# EAGLE design TeslaBMS_Shield_4 (EAGLE 6.6.0)
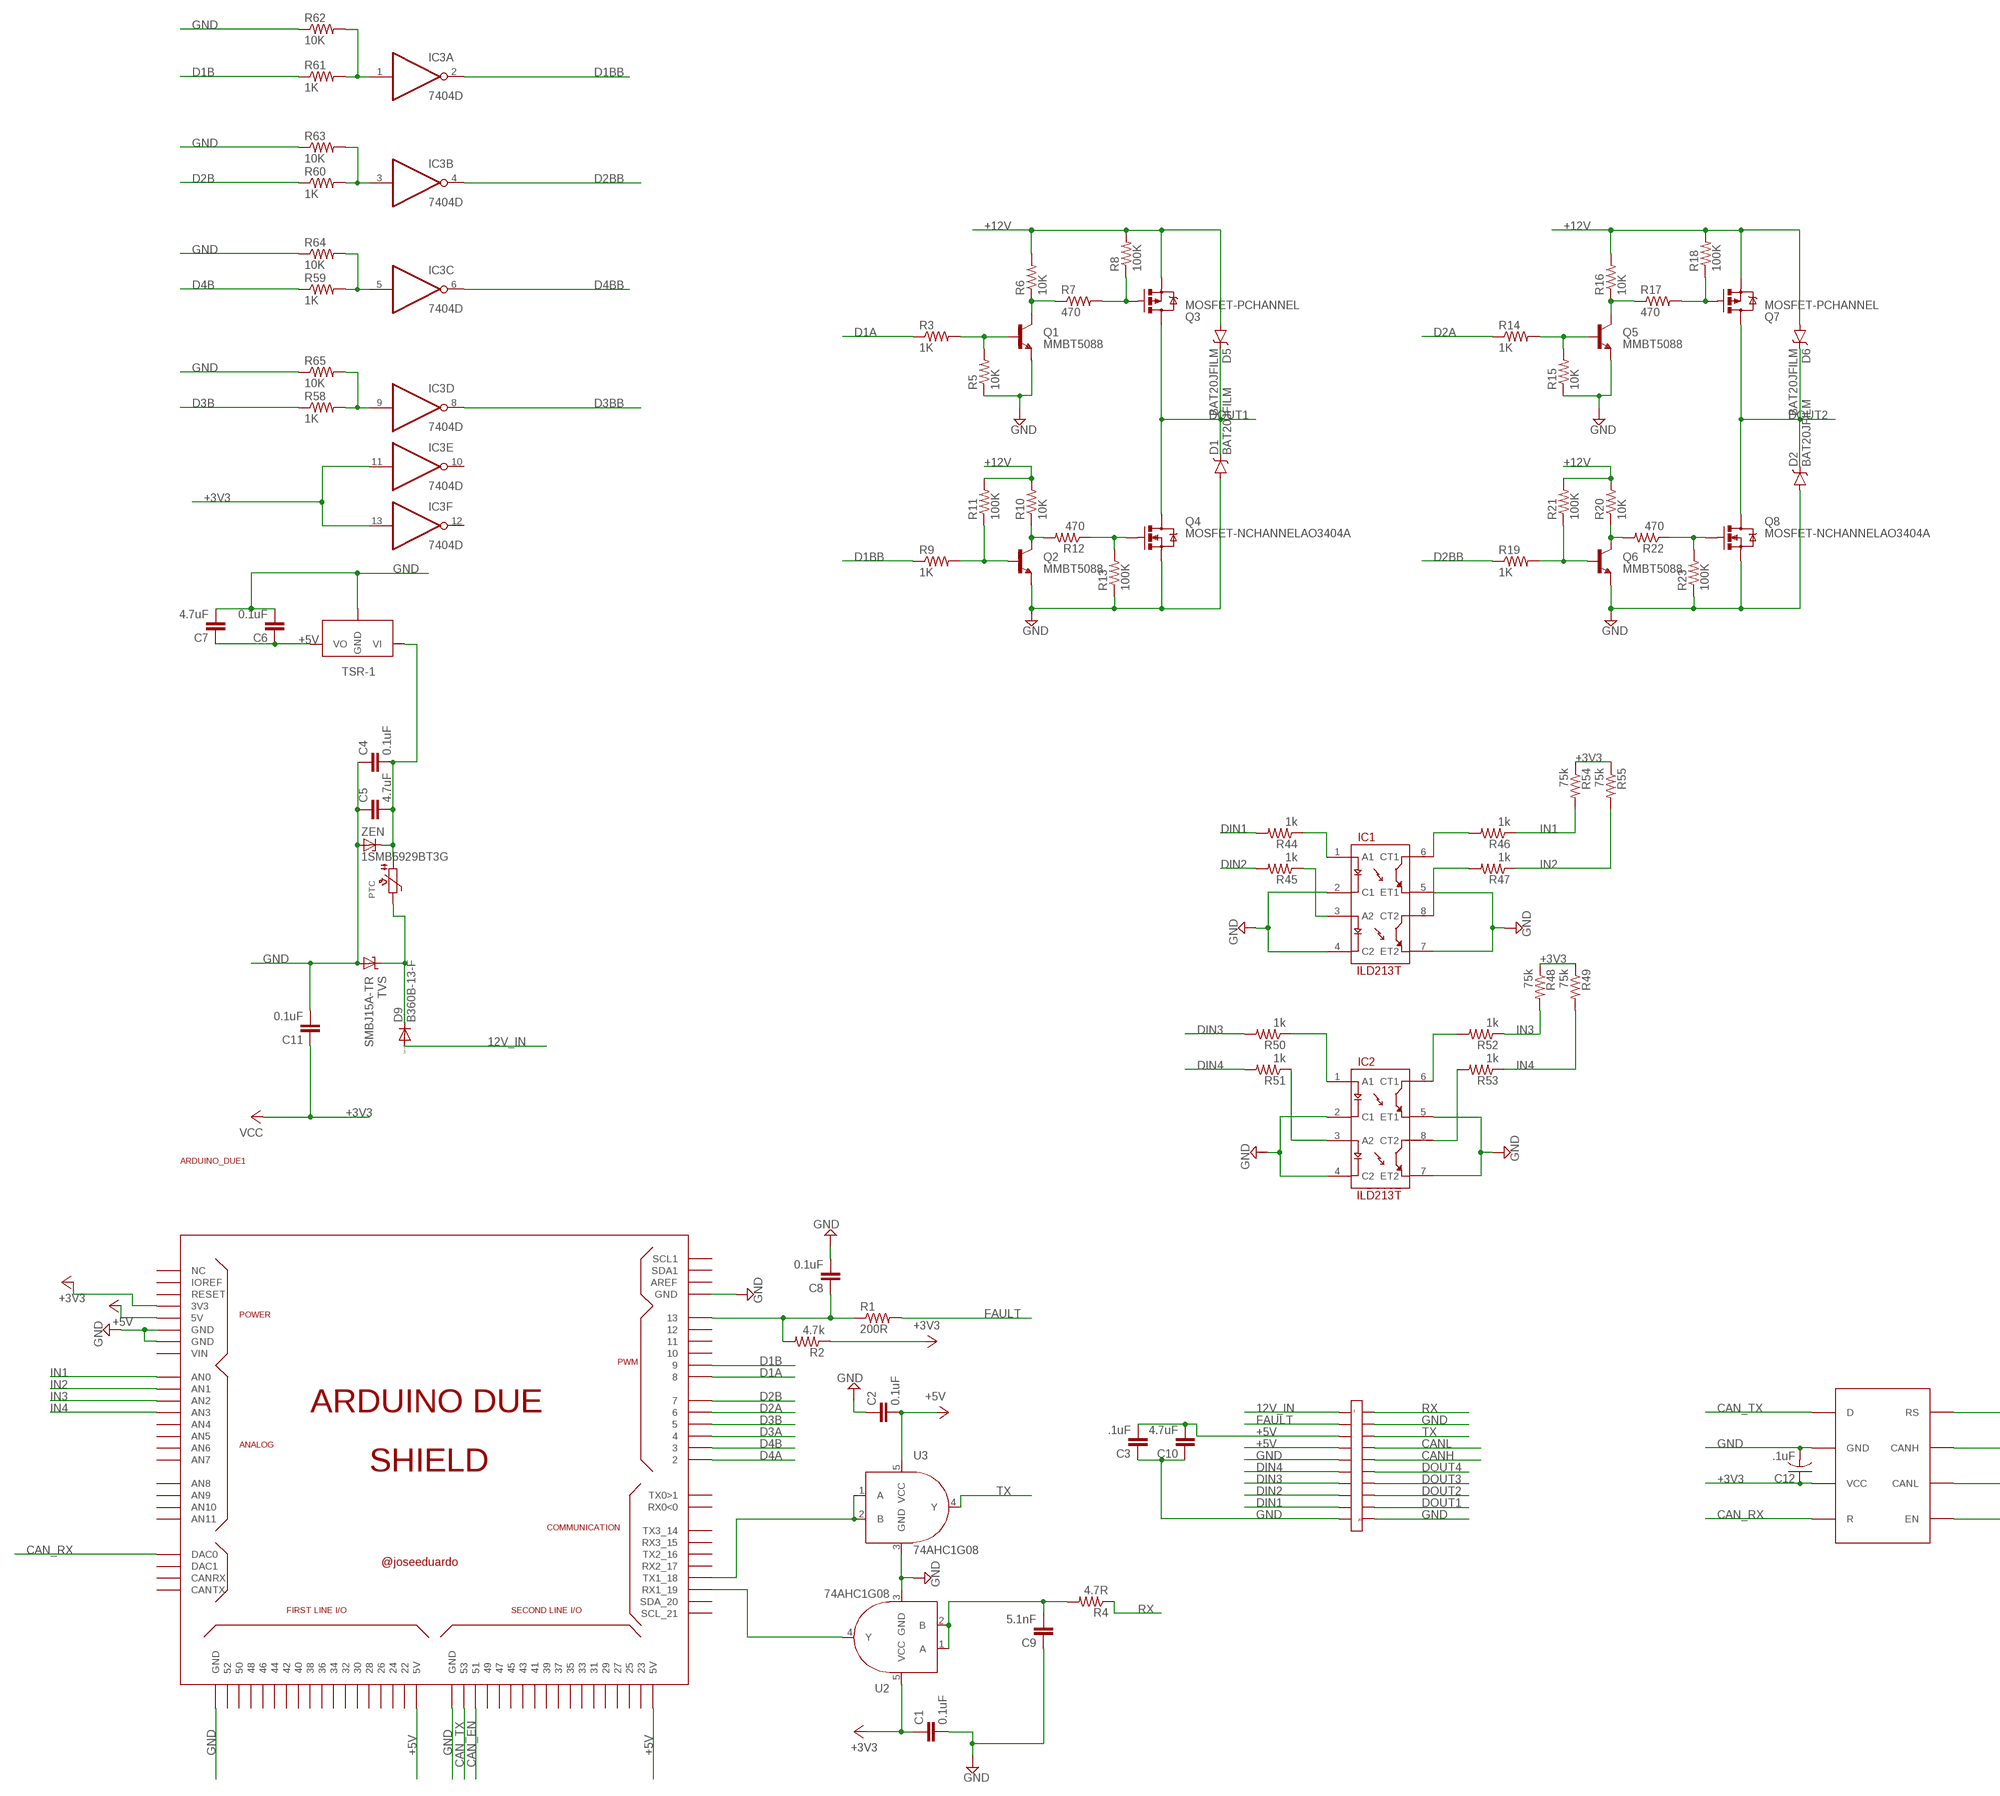
[diagram p0: schematic, sheet 1, part 1 of 2]
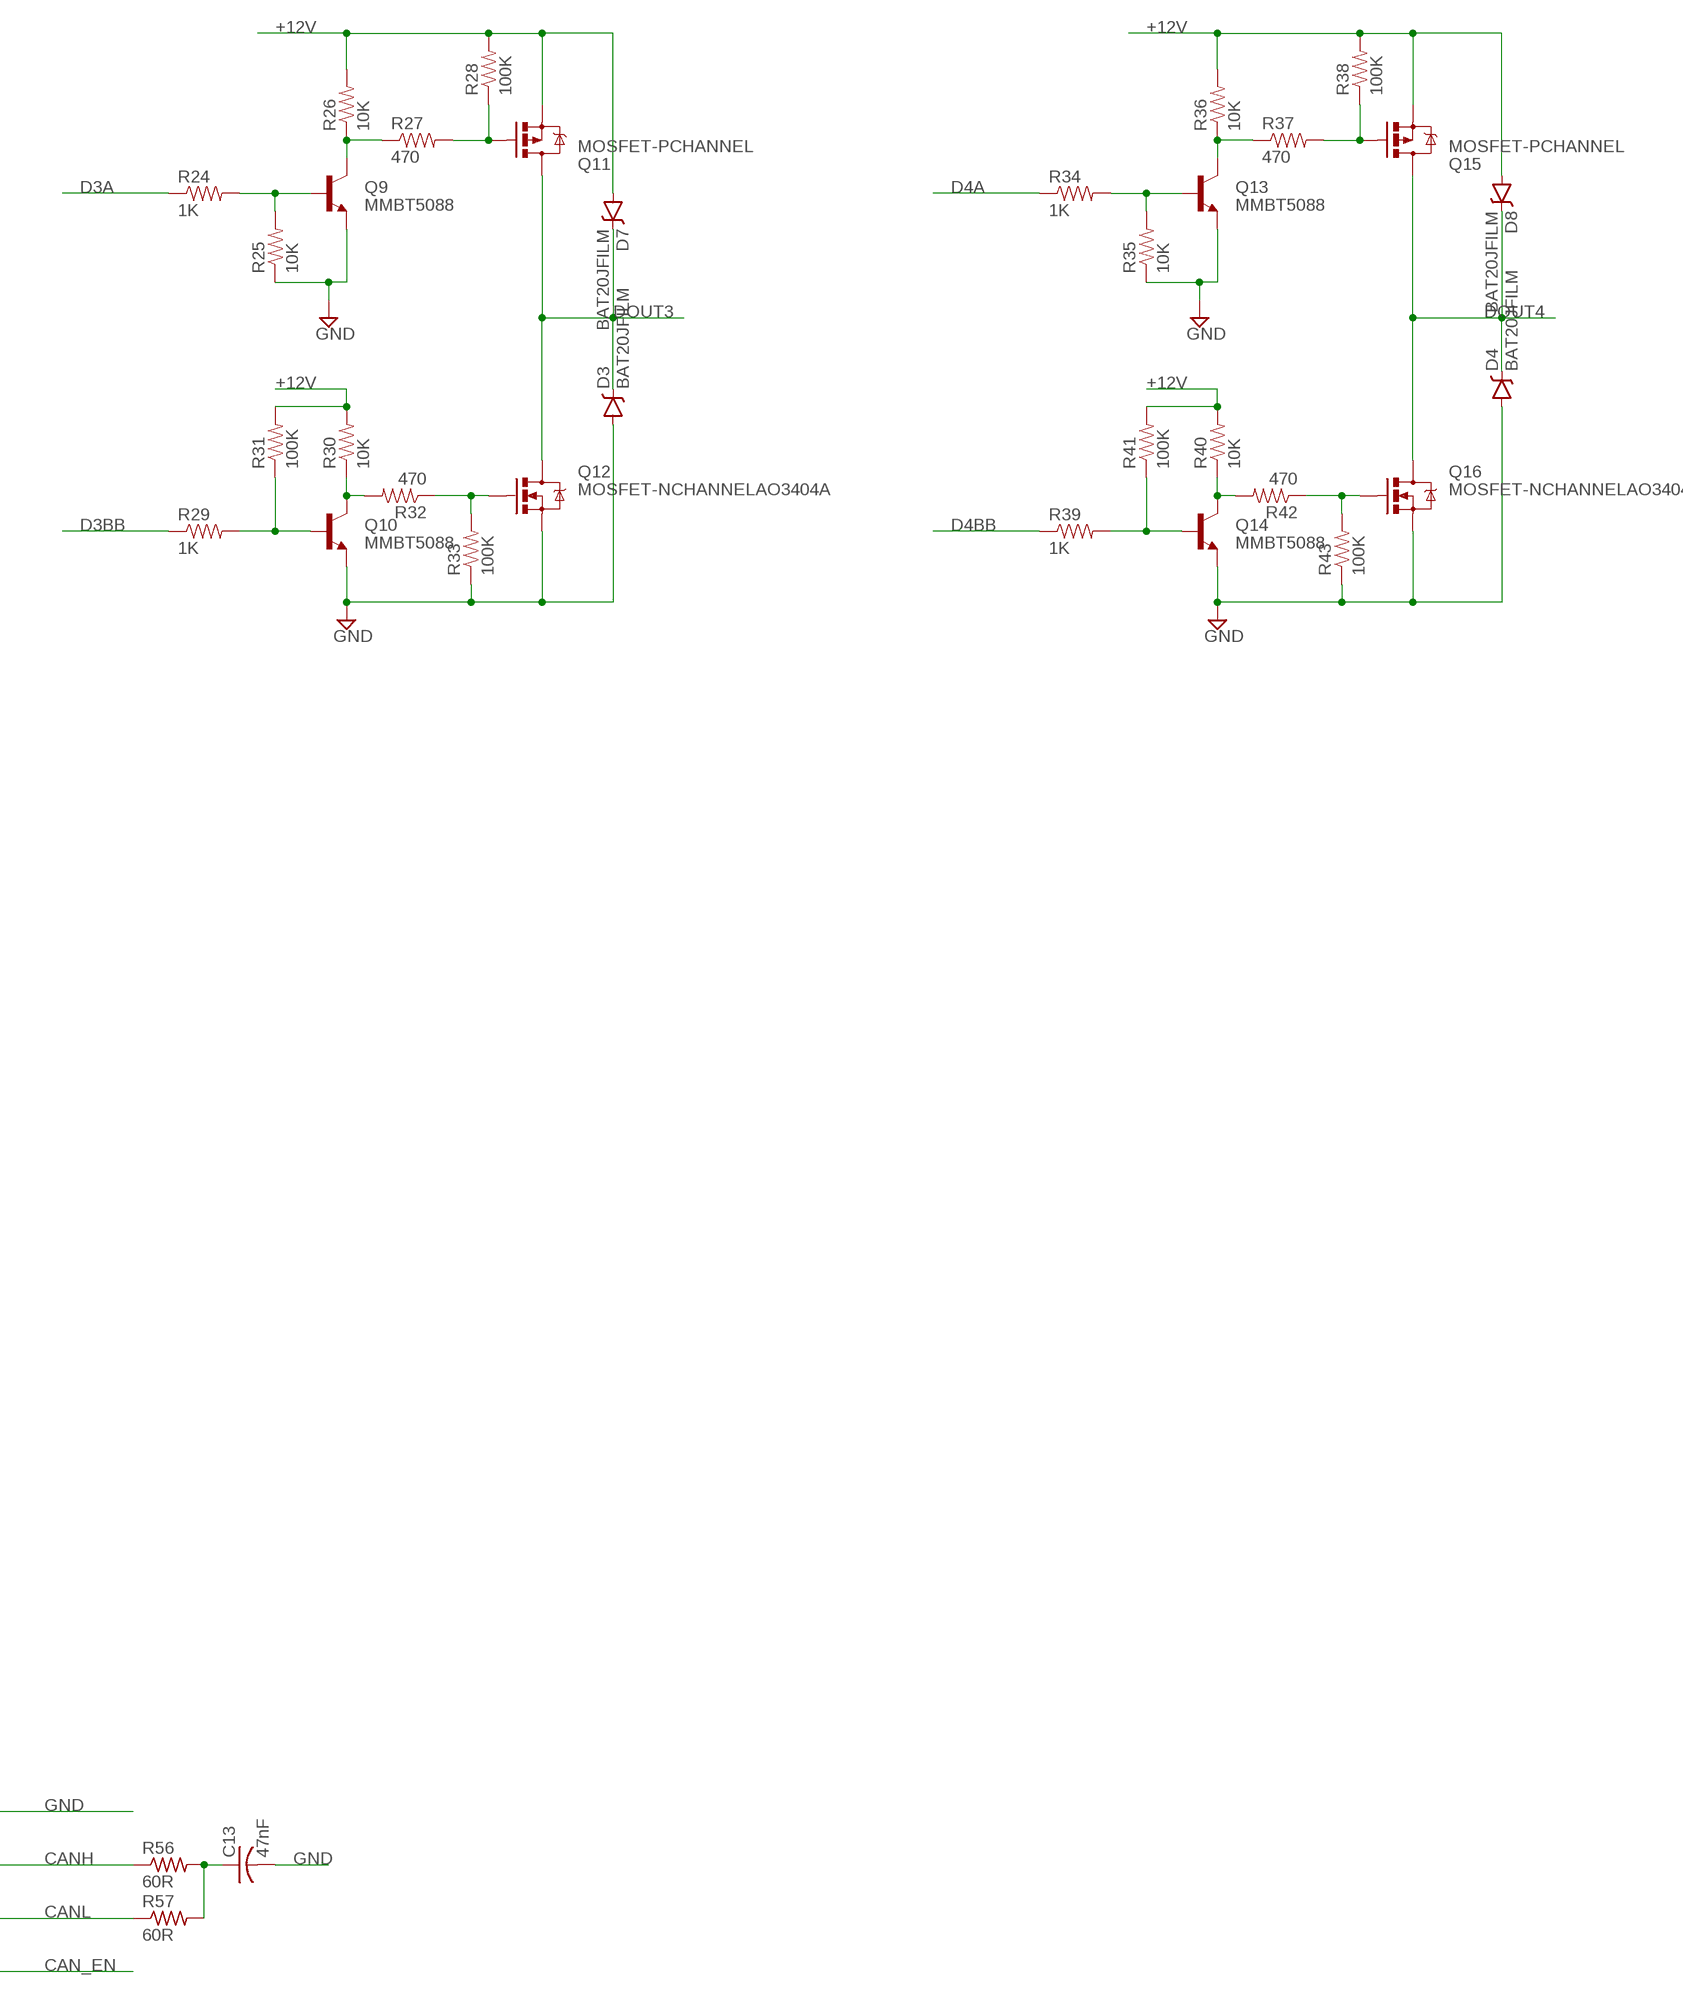
[diagram p1: schematic, sheet 1, part 2 of 2]

## Parts
ARDUINO_DUE1  ARDUINO_DUE_SHIELD  [ARDUINO_DUE_SHIELD]
C1  0.1uF  CAP0603-CAP  [0603-CAP]
C2  0.1uF  CAP0603-CAP  [0603-CAP]
C3  .1uF  CAP0603-CAP  [0603-CAP]
C4  0.1uF  CAP0805  [0805]
C5  4.7uF  CAP0805  [0805]
C6  0.1uF  CAP0805  [0805]
C7  4.7uF  CAP0805  [0805]
C8  0.1uF  CAP0603-CAP  [0603-CAP]
C9  5.1nF  CAP0603-CAP  [0603-CAP]
C10  4.7uF  CAP0603-CAP  [0603-CAP]
C11  0.1uF  CAP0805  [0805]
C12  .1uF  C-USC0603  [C0603]
C13  47nF  C-USC0805  [C0805]
D1  BAT20JFILM  [SOD-323]
D2  BAT20JFILM  [SOD-323]
D3  BAT20JFILM  [SOD-323]
D4  BAT20JFILM  [SOD-323]
D5  BAT20JFILM  [SOD-323]
D6  BAT20JFILM  [SOD-323]
D7  BAT20JFILM  [SOD-323]
D8  BAT20JFILM  [SOD-323]
D9  B360B-13-F  DIODE-SMB  [SMB]
IC1  ILD213T  [SO08]
IC2  ILD213T  [SO08]
IC3  7404D  [SO14]
PTC  PTC1812  [PTC1812]
Q1  MMBT5088  TRANSISTOR_NPNMMBT5088  [SOT23-3]
Q2  MMBT5088  TRANSISTOR_NPNMMBT5088  [SOT23-3]
Q3  MOSFET-PCHANNEL  [SOT23-3]
Q4  MOSFET-NCHANNELAO3404A  [SOT23-3]
Q5  MMBT5088  TRANSISTOR_NPNMMBT5088  [SOT23-3]
Q6  MMBT5088  TRANSISTOR_NPNMMBT5088  [SOT23-3]
Q7  MOSFET-PCHANNEL  [SOT23-3]
Q8  MOSFET-NCHANNELAO3404A  [SOT23-3]
Q9  MMBT5088  TRANSISTOR_NPNMMBT5088  [SOT23-3]
Q10  MMBT5088  TRANSISTOR_NPNMMBT5088  [SOT23-3]
Q11  MOSFET-PCHANNEL  [SOT23-3]
Q12  MOSFET-NCHANNELAO3404A  [SOT23-3]
Q13  MMBT5088  TRANSISTOR_NPNMMBT5088  [SOT23-3]
Q14  MMBT5088  TRANSISTOR_NPNMMBT5088  [SOT23-3]
Q15  MOSFET-PCHANNEL  [SOT23-3]
Q16  MOSFET-NCHANNELAO3404A  [SOT23-3]
R1  200R  RESISTOR0603-RES  [0603-RES]
R2  4.7k  RESISTOR0603-RES  [0603-RES]
R3  1K  RESISTOR0402  [0402-RES]
R4  4.7R  RESISTOR0603-RES  [0603-RES]
R5  10K  RESISTOR0402  [0402-RES]
R6  10K  RESISTOR0402  [0402-RES]
R7  470  RESISTOR0402  [0402-RES]
R8  100K  RESISTOR0402  [0402-RES]
R9  1K  RESISTOR0402  [0402-RES]
R10  10K  RESISTOR0402  [0402-RES]
R11  100K  RESISTOR0402  [0402-RES]
R12  470  RESISTOR0402  [0402-RES]
R13  100K  RESISTOR0402  [0402-RES]
R14  1K  RESISTOR0402  [0402-RES]
R15  10K  RESISTOR0402  [0402-RES]
R16  10K  RESISTOR0402  [0402-RES]
R17  470  RESISTOR0402  [0402-RES]
R18  100K  RESISTOR0402  [0402-RES]
R19  1K  RESISTOR0402  [0402-RES]
R20  10K  RESISTOR0402  [0402-RES]
R21  100K  RESISTOR0402  [0402-RES]
R22  470  RESISTOR0402  [0402-RES]
R23  100K  RESISTOR0402  [0402-RES]
R24  1K  RESISTOR0402  [0402-RES]
R25  10K  RESISTOR0402  [0402-RES]
R26  10K  RESISTOR0402  [0402-RES]
R27  470  RESISTOR0402  [0402-RES]
R28  100K  RESISTOR0402  [0402-RES]
R29  1K  RESISTOR0402  [0402-RES]
R30  10K  RESISTOR0402  [0402-RES]
R31  100K  RESISTOR0402  [0402-RES]
R32  470  RESISTOR0402  [0402-RES]
R33  100K  RESISTOR0402  [0402-RES]
R34  1K  RESISTOR0402  [0402-RES]
R35  10K  RESISTOR0402  [0402-RES]
R36  10K  RESISTOR0402  [0402-RES]
R37  470  RESISTOR0402  [0402-RES]
R38  100K  RESISTOR0402  [0402-RES]
R39  1K  RESISTOR0402  [0402-RES]
R40  10K  RESISTOR0402  [0402-RES]
R41  100K  RESISTOR0402  [0402-RES]
R42  470  RESISTOR0402  [0402-RES]
R43  100K  RESISTOR0402  [0402-RES]
R44  1k  RESISTOR0603-RES  [0603-RES]
R45  1k  RESISTOR0603-RES  [0603-RES]
R46  1k  RESISTOR0603-RES  [0603-RES]
R47  1k  RESISTOR0603-RES  [0603-RES]
R48  75k  RESISTOR0603-RES  [0603-RES]
R49  75k  RESISTOR0603-RES  [0603-RES]
R50  1k  RESISTOR0603-RES  [0603-RES]
R51  1k  RESISTOR0603-RES  [0603-RES]
R52  1k  RESISTOR0603-RES  [0603-RES]
R53  1k  RESISTOR0603-RES  [0603-RES]
R54  75k  RESISTOR0603-RES  [0603-RES]
R55  75k  RESISTOR0603-RES  [0603-RES]
R56  60R  R-US_M0805  [M0805]
R57  60R  R-US_M0805  [M0805]
R58  1K  RESISTOR0402  [0402-RES]
R59  1K  RESISTOR0402  [0402-RES]
R60  1K  RESISTOR0402  [0402-RES]
R61  1K  RESISTOR0402  [0402-RES]
R62  10K  RESISTOR0402  [0402-RES]
R63  10K  RESISTOR0402  [0402-RES]
R64  10K  RESISTOR0402  [0402-RES]
R65  10K  RESISTOR0402  [0402-RES]
TVS  SMBJ15A-TR  SUPPRESSOR-SMBJ  [SMBJ]
U1  SN65HVD234  [SOIC8]
U2  74AHC1G08  [SOT353]
U3  74AHC1G08  [SOT353]
U9  TSR-1  [TSR-1]
U$2  VAL-U-LOK-20PIN  [VALULOK-20]
ZEN  1SMB5929BT3G  ZENER-DIODESMB  [SMB]

## Nets
12V_IN: D9.A U$2.P$1
+3V3: ARDUINO_DUE1.3V3 C1.1 C11.1 C12.1 IC3.11(E:I) IC3.13(F:I) R2.1 R48.1 R49.1 R54.1 R55.1 U1.PIN3(VCC) U2.5(VCC) ; supply symbol labelled VCC
+5V: ARDUINO_DUE1.5V0(5V) ARDUINO_DUE1.5V0_1(5V) ARDUINO_DUE1.5V0_2(5V) C2.2 C3.2 C6.1 C7.1 C10.2 U3.5(VCC) U9.P$3(VO) U$2.P$3 U$2.P$4
+12V: C4.2 C5.2 D5.A D6.A D7.A D8.A PTC.P$1 Q3.2(S) Q7.2(S) Q11.2(S) Q15.2(S) R6.2 R8.2 R10.2 R11.2 R16.2 R18.2 R20.2 R21.2 R26.2 R28.2 R30.2 R31.2 R36.2 R38.2 R40.2 R41.2 U9.P$1(VI) ZEN.C
CAN_EN: ARDUINO_DUE1.51 U1.PIN5(EN)
CAN_RX: ARDUINO_DUE1.DAC0 U1.PIN4(R)
CAN_TX: ARDUINO_DUE1.53 U1.PIN1(D)
CANH: R56.1 U1.PIN7(CANH) U$2.P$15
CANL: R57.1 U1.PIN6(CANL) U$2.P$14
D1A: ARDUINO_DUE1.8 R3.1
D1B: ARDUINO_DUE1.9 R61.1
D1BB: IC3.2(A:O) R9.1
D2A: ARDUINO_DUE1.6 R14.1
D2B: ARDUINO_DUE1.7 R60.1
D2BB: IC3.4(B:O) R19.1
D3A: ARDUINO_DUE1.4 R24.1
D3B: ARDUINO_DUE1.5 R58.1
D3BB: IC3.8(D:O) R29.1
D4A: ARDUINO_DUE1.2 R34.1
D4B: ARDUINO_DUE1.3 R59.1
D4BB: IC3.6(C:O) R39.1
DIN1: R44.2 U$2.P$9
DIN2: R45.2 U$2.P$8
DIN3: R50.2 U$2.P$7
DIN4: R51.2 U$2.P$6
DOUT1: D1.C D5.C Q3.3(D) Q4.3(D) U$2.P$19
DOUT2: D2.C D6.C Q7.3(D) Q8.3(D) U$2.P$18
DOUT3: D3.C D7.C Q11.3(D) Q12.3(D) U$2.P$17
DOUT4: D4.C D8.C Q15.3(D) Q16.3(D) U$2.P$16
FAULT: R1.2 U$2.P$2
GND: ARDUINO_DUE1.GND ARDUINO_DUE1.GND_1(GND) ARDUINO_DUE1.GND_2(GND) ARDUINO_DUE1.GND_3(GND) ARDUINO_DUE1.GND_4(GND) C1.2 C2.1 C3.1 C4.1 C5.1 C6.2 C7.2 C8.2 C9.1 C10.1 C11.2 C12.2 C13.2 D1.A D2.A D3.A D4.A IC1.2(C1) IC1.4(C2) IC1.5(ET1) IC1.7(ET2) IC2.2(C1) IC2.4(C2) IC2.5(ET1) IC2.7(ET2) Q1.2(E) Q2.2(E) Q4.2(S) Q5.2(E) Q6.2(E) Q8.2(S) Q9.2(E) Q10.2(E) Q12.2(S) Q13.2(E) Q14.2(E) Q16.2(S) R5.1 R13.1 R15.1 R23.1 R25.1 R33.1 R35.1 R43.1 R62.1 R63.1 R64.1 R65.1 TVS.A U1.PIN2(GND) U1.PIN8(RS) U2.3(GND) U3.3(GND) U9.P$2(GND) U$2.P$5 U$2.P$10 U$2.P$12 U$2.P$20 ZEN.A
IN1: ARDUINO_DUE1.A0(AN0) R46.1 R54.2
IN2: ARDUINO_DUE1.A1(AN1) R47.1 R55.2
IN3: ARDUINO_DUE1.A2(AN2) R48.2 R52.1
IN4: ARDUINO_DUE1.A3(AN3) R49.2 R53.1
N$1: D9.C PTC.P$2 TVS.C
N$2: ARDUINO_DUE1.19(RX1_19) U2.4(Y)
N$3: ARDUINO_DUE1.18(TX1_18) U3.1(A) U3.2(B)
N$4: Q1.1(B) R3.2 R5.2
N$5: Q3.1(G) R7.2 R8.1
N$6: IC1.3(A2) R45.1
N$7: ARDUINO_DUE1.13 C8.1 R1.1 R2.2
N$8: Q1.3(C) R6.1 R7.1
N$9: C9.2 R4.2 U2.1(A) U2.2(B)
N$10: Q5.1(B) R14.2 R15.2
N$11: Q2.1(B) R9.2 R11.1
N$12: Q4.1(G) R12.1 R13.2
N$13: Q2.3(C) R10.1 R12.2
N$14: Q5.3(C) R16.1 R17.1
N$15: Q7.1(G) R17.2 R18.1
N$16: Q6.1(B) R19.2 R21.1
N$17: Q8.1(G) R22.1 R23.2
N$18: Q6.3(C) R20.1 R22.2
N$19: Q9.1(B) R24.2 R25.2
N$20: Q9.3(C) R26.1 R27.1
N$21: Q11.1(G) R27.2 R28.1
N$22: Q10.1(B) R29.2 R31.1
N$23: Q12.1(G) R32.1 R33.2
N$24: Q10.3(C) R30.1 R32.2
N$25: Q13.1(B) R34.2 R35.2
N$26: Q13.3(C) R36.1 R37.1
N$27: Q15.1(G) R37.2 R38.1
N$28: Q14.1(B) R39.2 R41.1
N$29: Q16.1(G) R42.1 R43.2
N$30: Q14.3(C) R40.1 R42.2
N$31: IC1.1(A1) R44.1
N$32: IC2.6(CT1) R52.2
N$33: C13.1 R56.2 R57.2
N$34: IC3.9(D:I) R58.2 R65.2
N$35: IC3.5(C:I) R59.2 R64.2
N$36: IC2.8(CT2) R53.2
N$37: IC1.6(CT1) R46.2
N$38: IC1.8(CT2) R47.2
N$39: IC3.3(B:I) R60.2 R63.2
N$40: IC3.1(A:I) R61.2 R62.2
N$41: IC2.1(A1) R50.1
N$42: IC2.3(A2) R51.1
RX: R4.1 U$2.P$11
TX: U3.4(Y) U$2.P$13
Unconnected: ARDUINO_DUE1.0(RX0<0) ARDUINO_DUE1.1(TX0>1) ARDUINO_DUE1.10 ARDUINO_DUE1.11 ARDUINO_DUE1.12 ARDUINO_DUE1.14(TX3_14) ARDUINO_DUE1.15(RX3_15) ARDUINO_DUE1.16(TX2_16) ARDUINO_DUE1.17(RX2_17) ARDUINO_DUE1.20(SDA_20) ARDUINO_DUE1.21(SCL_21) ARDUINO_DUE1.22 ARDUINO_DUE1.23 ARDUINO_DUE1.24 ARDUINO_DUE1.25 ARDUINO_DUE1.26 ARDUINO_DUE1.27 ARDUINO_DUE1.28 ARDUINO_DUE1.29 ARDUINO_DUE1.30 ARDUINO_DUE1.31 ARDUINO_DUE1.32 ARDUINO_DUE1.33 ARDUINO_DUE1.34 ARDUINO_DUE1.35 ARDUINO_DUE1.36 ARDUINO_DUE1.37 ARDUINO_DUE1.38 ARDUINO_DUE1.39 ARDUINO_DUE1.40 ARDUINO_DUE1.41 ARDUINO_DUE1.42 ARDUINO_DUE1.43 ARDUINO_DUE1.44 ARDUINO_DUE1.45 ARDUINO_DUE1.46 ARDUINO_DUE1.47 ARDUINO_DUE1.48 ARDUINO_DUE1.49 ARDUINO_DUE1.50 ARDUINO_DUE1.52 ARDUINO_DUE1.A4(AN4) ARDUINO_DUE1.A5(AN5) ARDUINO_DUE1.A6(AN6) ARDUINO_DUE1.A7(AN7) ARDUINO_DUE1.A8(AN8) ARDUINO_DUE1.A9(AN9) ARDUINO_DUE1.A10(AN10) ARDUINO_DUE1.A11(AN11) ARDUINO_DUE1.AREF ARDUINO_DUE1.CANRX ARDUINO_DUE1.CANTX ARDUINO_DUE1.DAC1 ARDUINO_DUE1.IOREF ARDUINO_DUE1.NC_2(NC) ARDUINO_DUE1.RESET ARDUINO_DUE1.SCL1 ARDUINO_DUE1.SDA1 ARDUINO_DUE1.VIN IC3.10(E:O) IC3.12(F:O)

## Power pins joined to a net without a drawn wire
+3V3: IC3.14(P:VCC)
GND: IC3.7(P:GND)

## Library data of the parts
ARDUINO_DUE1 = arduino_due_shield:ARDUINO_DUE_SHIELD
C1-C11 = SparkFun-Passives:CAP: Capacitor Standard 0603 ceramic capacitor, and 0.1" leaded capacitor.
C12 C13 = rcl:C-US: CAPACITOR, American symbol
D1-D8 = SparkFun-DiscreteSemi:BAT20JFILM: 23V, 1A Schottky diode, SOD-323 package; PROD_ID: DIO-11623
D9 = diode:DIODE-: DIODE
IC1 IC2 = SparkFun-DiscreteSemi:ILD213T: Dual optoisolator.
IC3 = 74xx-us:74*04: Hex INVERTER
PTC = microbuilder:PTC: PTC (Resettable Fuse) 1206 Package 250mA PTC (16V Max, Time-to-Trip: 0.08s) - Digikey: F2110CT-ND 1210 Package 100mA PTC (30V Max, Time-to-Trip: 0.6s) - Digikey: MF-USMF010-2CT-ND 1812 Package 750mA PTC (24V Max, Time-to-Trip: 0.2s) - Digikey: MF-MSMF075/24-2CT-ND
Q1 Q2 Q5 Q6 Q9 Q10 Q13 Q14 = SparkFun-DiscreteSemi:TRANSISTOR_NPN: Generic NPN BJT MMBT2222A - TRANS-08049 (SOT-23, 1A 40V) MPSA42 - TRANS-09116 (SOT-23, 500mA 300V) MMBT5088LT1G - TRANS-11160 (SOT-23, 50 mA 30V) BC547 - COM-08928 <http://www.sparkfun.com/products/8928> (TO-92 45V 100mA) (1.Collector 2.Base 3.Emitter) 2N3904 - COM-00521 <http://www.sparkfun.com/products/521> (TO-92 40V 200mA) (1.Emitter 2.Base 3.Collector) P2N2222A - COM-12852 <http://www.sparkfun.com/products/12852> (TO-92 40V 600mA) (1.Collector 2.Base 3.Emitter); PROD_ID: TRANS-11160
Q3 Q7 Q11 Q15 = SparkFun-DiscreteSemi:MOSFET-PCHANNEL: Generic PMOSFET IRLML2244 - TRANS-11153 (SOT-23 -20V -4.3A) (1.Gate 2.Source 3.Drain) FQP27P06 - COM-10349 <http://www.sparkfun.com/products/10349> (TO-220 -60V -27A) (1.Gate 2.Source 3.Drain); PROD_ID: TRANS-08285
Q4 Q8 Q12 Q16 = SparkFun-DiscreteSemi:MOSFET-NCHANNEL: Common NMOSFET Parts MFG P/N Store ID Prod ID FDD8780 TRANS-09984 SI7820DN TRANS-11055 FDS6630A IC-08089 2N7002PW TRANS-11151 FQP30N06L COM-10213 TRANS-10060 BSS123LT1G TRANS-08345 BSS138 TRANS-00830 BS170 2N7000; PROD_ID: TRAN-12988
R1 R2 R4 R44-R55 = SparkFun-Passives:RESISTOR: Resistor Basic schematic elements and footprints for 0603, 1206, and PTH resistors.
R3 R5-R43 R58-R65 = SparkFun-Resistors:RESISTOR: Resistor Basic schematic elements and footprints for 0603, 1206, and PTH resistors.
R56 R57 = rcl:R-US_: RESISTOR, American symbol
TVS = diode:SUPPRESSOR-: Suppressor diode
U1 = ck_custom:SN65HVD234
U2 U3 = SparkFun-DigitalIC:74AHC1G08: Single 2-input AND gate; PROD_ID: IC-10841
U9 = Traco:TSR-1
U$2 = ck_custom:VAL-U-LOK-20PIN
ZEN = diode:ZENER-DIODE: Z-Diode

## Net classes
0 default: width 0.203 mm, drill 0.305 mm, clearance 0.203 mm

## Board
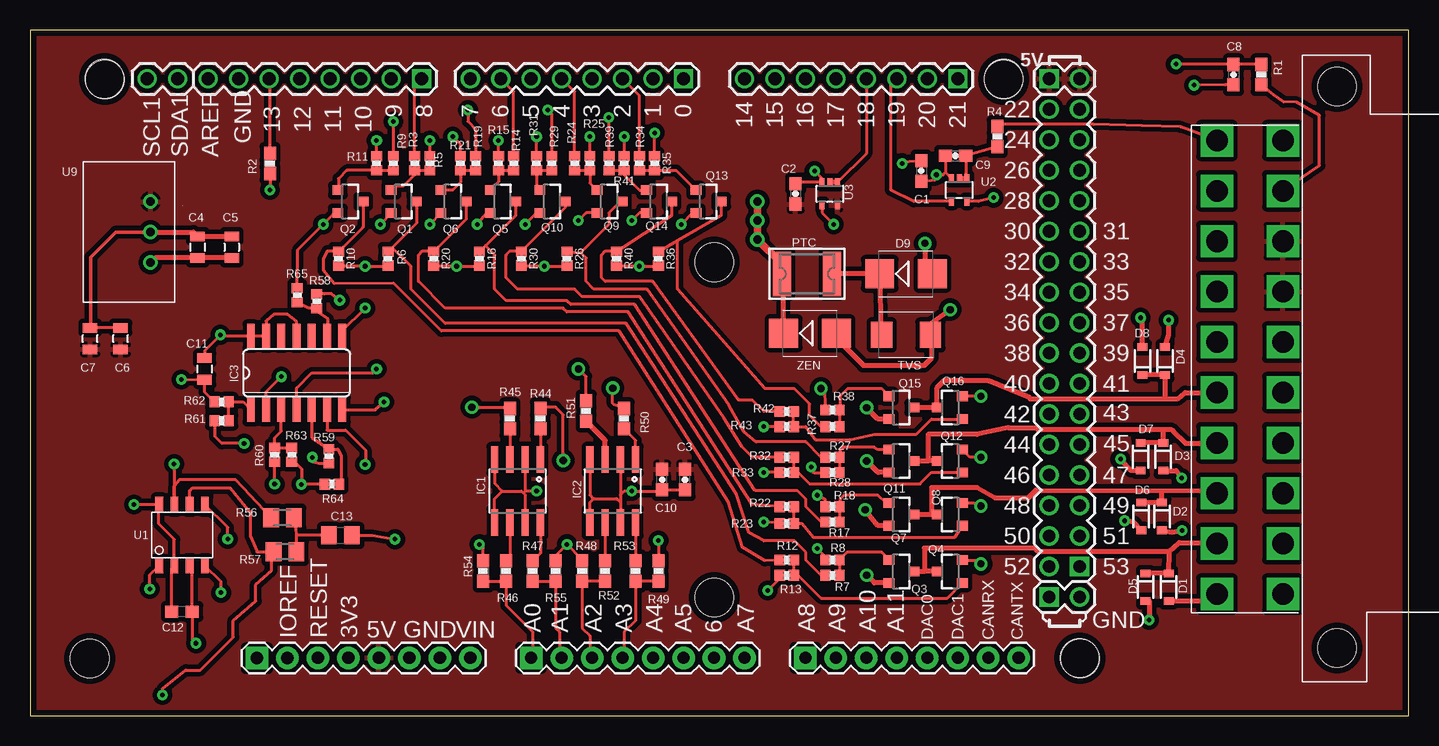
[diagram p2: board, top side]
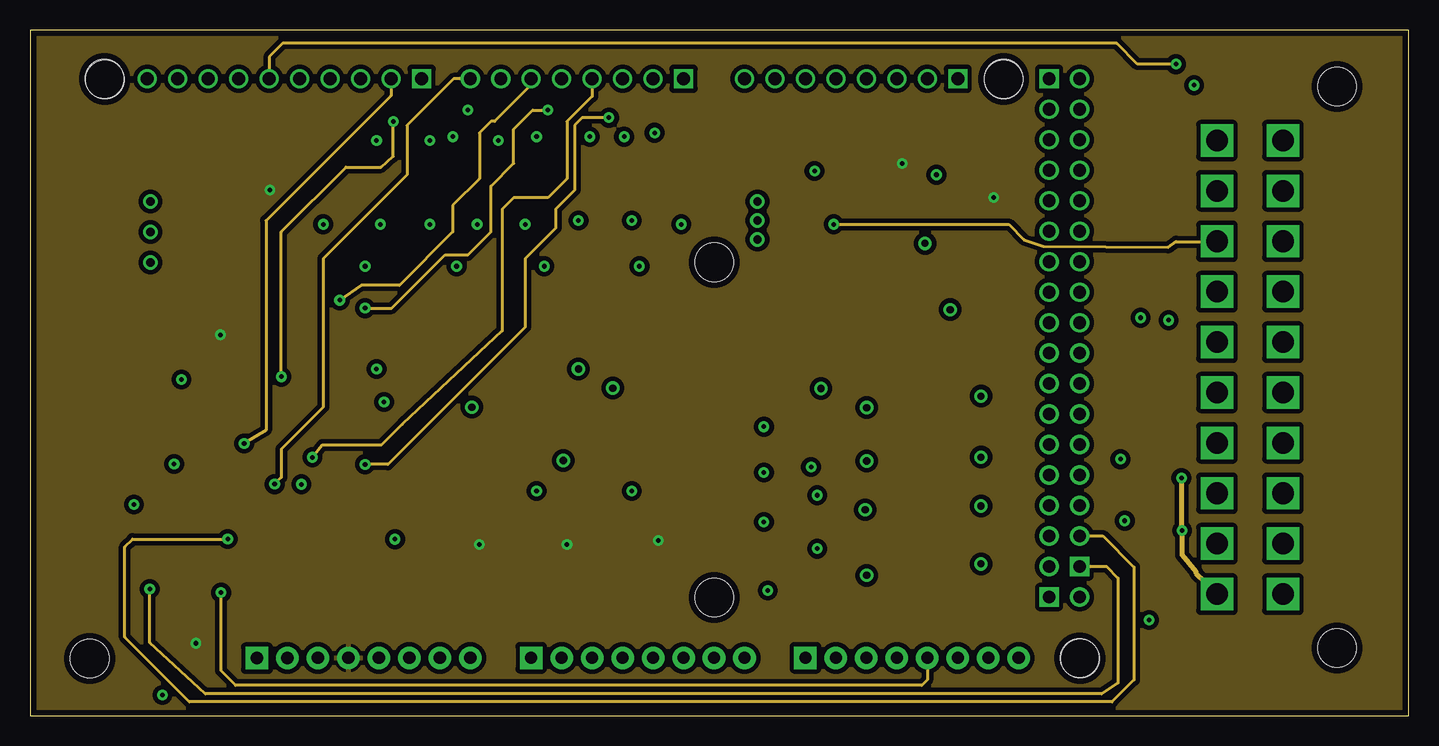
[diagram p3: board, inner layer Route2]
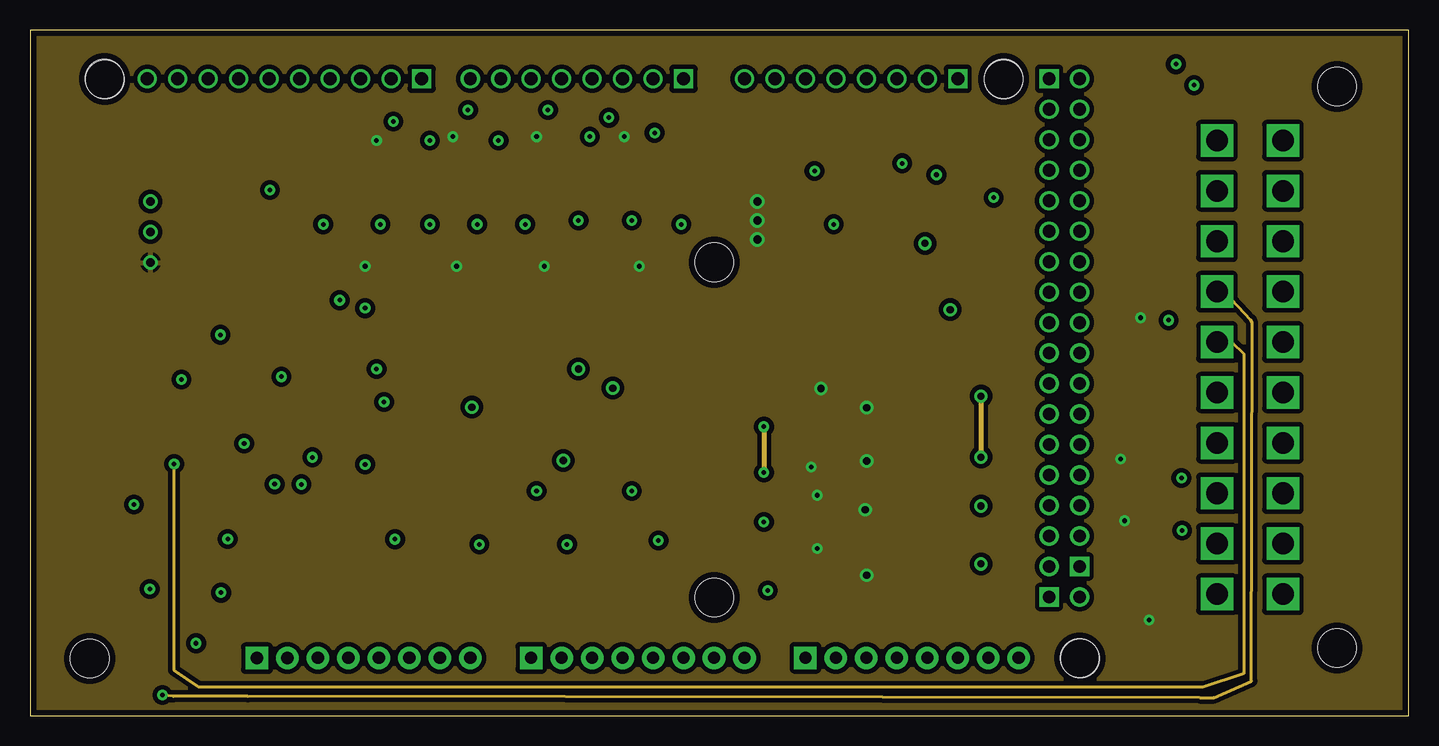
[diagram p4: board, inner layer Route15]
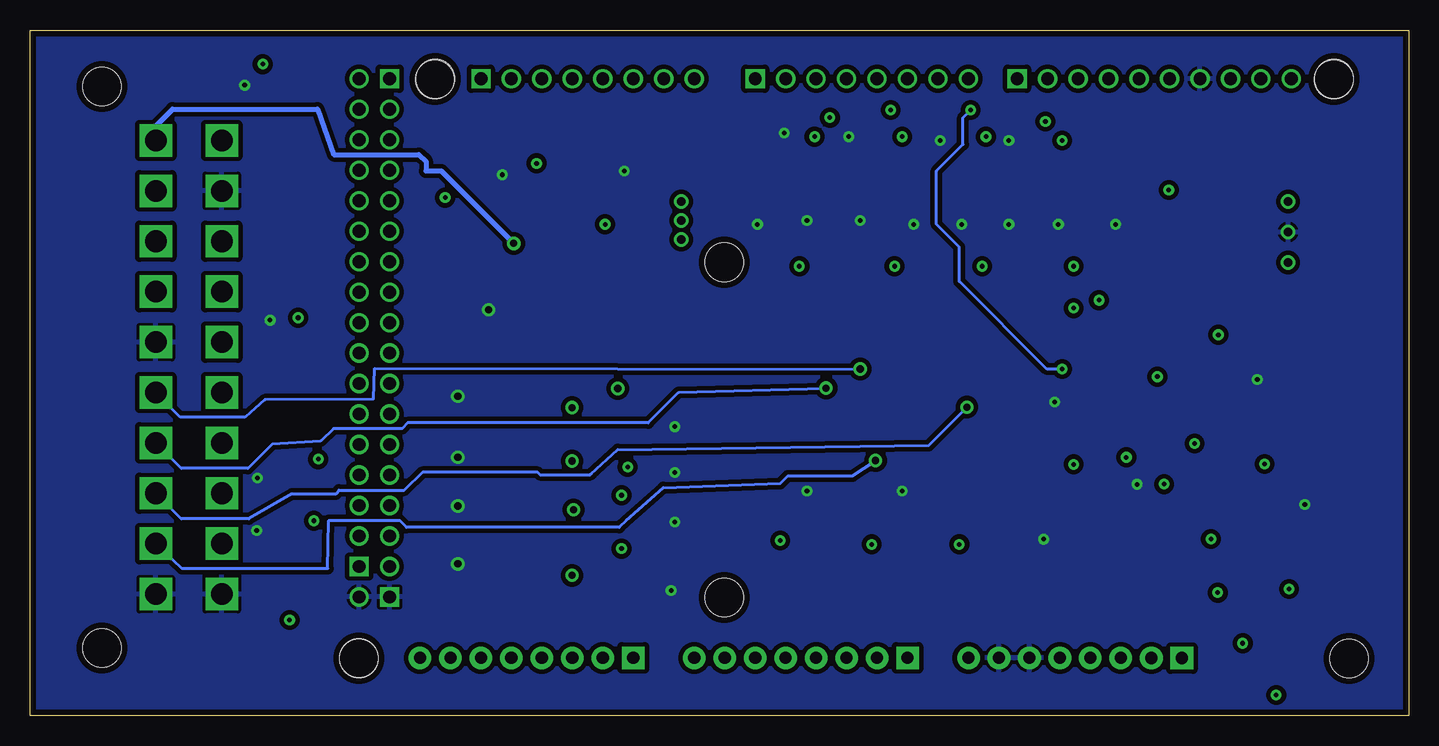
[diagram p5: board, bottom side, seen from below]

Size 114.94 x 57.15 mm. Coordinates in mm from the lower left corner, seen from the top.
Outline: 0,0 114.94,0 114.94,57.15 0,57.15 0,0
Copper layers (1+2*15+16): Top 0.0178mm / dielectric 12mil / Route2 0.0356mm / dielectric 28mil / Route15 0.0356mm / dielectric 12mil / Bottom 0.0178mm
Design rules "SSC-EAGLE-4Lyr_v1.0.0.3 *": minimum track width 6mil, minimum drill 8mil, track to track 15mil, track to pad 15mil, pad to pad 15mil, via to via 15mil, smd to smd 6mil, copper to edge 20mil, drill to drill 16mil, minimum pad ring 10mil, minimum via ring 10mil, stop-mask expansion 10mil, vias tented up to drill 0mil, thermal gap 10mil

### Footprints (pad centres in the part's own frame; a part is rotated, then mirrored left to right if it is on the bottom)
ARDUINO_DUE_SHIELD = drill 1.067 square: 0 63.373,51.816; 5V0_1 93.853,51.816; 8 41.529,51.816; 21 86.233,51.816; 53 96.393,11.176; GND_2 93.853,8.636 | drill 1.067: 1 60.833,51.816; 2 58.293,51.816; 3 55.753,51.816; 4 53.213,51.816; 5 50.673,51.816; 5V0_2 96.393,51.816; 6 48.133,51.816; 7 45.593,51.816; 9 38.989,51.816; 10 36.449,51.816; 11 33.909,51.816; 12 31.369,51.816; 13 28.829,51.816; 14 68.453,51.816; 15 70.993,51.816; 16 73.533,51.816; 17 76.073,51.816; 18 78.613,51.816; 19 81.153,51.816; 20 83.693,51.816; 22 93.853,49.276; 23 96.393,49.276; 24 93.853,46.736; 25 96.393,46.736; 26 93.853,44.196; 27 96.393,44.196; 28 93.853,41.656; 29 96.393,41.656; 30 93.853,39.116; 31 96.393,39.116; 32 93.853,36.576; 33 96.393,36.576; 34 93.853,34.036; 35 96.393,34.036; 36 93.853,31.496; 37 96.393,31.496; 38 93.853,28.956; 39 96.393,28.956; 40 93.853,26.416; 41 96.393,26.416; 42 93.853,23.876; 43 96.393,23.876; 44 93.853,21.336; 45 96.393,21.336; 46 93.853,18.796; 47 96.393,18.796; 48 93.853,16.256; 49 96.393,16.256; 50 93.853,13.716; 51 96.393,13.716; 52 93.853,11.176; AREF 23.749,51.816; GND_3 96.393,8.636; GND_4 26.289,51.816; SCL1 18.669,51.816; SDA1 21.209,51.816 | drill 1.016 pad 1.88: 3V3 35.433,3.556; 5V0 37.973,3.556; A1 53.213,3.556; A2 55.753,3.556; A3 58.293,3.556; A4 60.833,3.556; A5 63.373,3.556; A6 65.913,3.556; A7 68.453,3.556; A9 76.073,3.556; A10 78.613,3.556; A11 81.153,3.556; CANRX 88.773,3.556; CANTX 91.313,3.556; DAC0 83.693,3.556; DAC1 86.233,3.556; GND 40.513,3.556; GND_1 43.053,3.556; IOREF 30.346,3.543; RESET 32.893,3.555; VIN 45.593,3.556 | drill 1.016 pad 1.88 square: A0 50.673,3.556; A8 73.533,3.556; NC_2 27.806,3.543 | hole 3.2: 15.113,51.816; 90.043,51.816; 96.393,3.556; 96.418,3.505; 15.138,51.765; 90.068,51.765; 13.868,3.505; 65.938,36.525; 65.938,8.585
0603-CAP = smd 1.1 x 1: 1 -0.85,0; 2 0.85,0
0805 = smd 0.8 x 1.2: 1 -0.9,0; 2 0.9,0
C0603 = smd 1.1 x 1: 1 -0.85,0; 2 0.85,0
C0805 = smd 1.3 x 1.5: 1 -0.95,0; 2 0.95,0
SOD-323 = smd 0.63 x 0.83: A 1.15,0; C -1.15,0
SMB = smd 2.4 x 2.4: A 2.2,0; C -2.2,0
SO08 = smd 0.61 x 2.21: 1 -1.905,-2.616; 2 -0.635,-2.616; 3 0.635,-2.616; 4 1.905,-2.616; 5 1.905,2.616; 6 0.635,2.616; 7 -0.635,2.616; 8 -1.905,2.616
SO14 = smd 0.66 x 2.032: 1 -3.81,-3.073; 2 -2.54,-3.073; 3 -1.27,-3.073; 4 0,-3.073; 5 1.27,-3.073; 6 2.54,-3.073; 7 3.81,-3.073; 8 3.81,3.073; 9 2.54,3.073; 10 1.27,3.073; 11 0,3.073; 12 -1.27,3.073; 13 -2.54,3.073; 14 -3.81,3.073
PTC1812 = smd 1.5 x 3.7: P$1 -2.1,0; P$2 2.1,0
SOT23-3 = smd 0.8 x 0.9: 1 -0.95,-1; 2 0.95,-1; 3 0,1.1
0603-RES = smd 1.1 x 1: 1 -0.85,0; 2 0.85,0
0402-RES = smd 0.85 x 0.9: 1 -0.58,0; 2 0.58,0
M0805 = smd 1.3 x 1.6: 1 -0.95,0; 2 0.95,0
SMBJ = smd 1.78 x 2.16: A 2.04,0; C -2.03,0
SOIC8 = smd 0.635 x 1.27: PIN1 0.635,-0.635; PIN2 1.905,-0.635; PIN3 3.175,-0.635; PIN4 4.445,-0.635; PIN5 4.445,4.445; PIN6 3.175,4.445; PIN7 1.905,4.445; PIN8 0.635,4.445
SOT353 = smd 0.42 x 0.7: 1 -0.65,-0.95; 2 0,-0.95; 3 0.65,-0.95; 4 0.65,0.95; 5 -0.65,0.95
TSR-1 = drill 0.7: P$1 -2.55,-1.8; P$2 -0.01,-1.8; P$3 2.53,-1.8
VALULOK-20 = drill 1.8 square: P$1 0,0; P$2 0,4.2; P$3 0,8.4; P$4 0,12.6; P$5 0,16.8; P$6 0,21; P$7 0,25.2; P$8 0,29.4; P$9 0,33.6; P$10 0,37.8; P$11 5.5,0; P$12 5.5,4.2; P$13 5.5,8.4; P$14 5.5,12.6; P$15 5.5,16.8; P$16 5.5,21; P$17 5.5,25.2; P$18 5.5,29.4; P$19 5.5,33.6; P$20 5.5,37.8 | hole 3.2: -4.5,-4.5; -4.5,42.3

### Placement (x,y rotation side)
ARDUINO_DUE1  -8.89,1.27 0 top
C1  74.3,45.4 270 top
C2  63.82,43.5 270 top
C3  54.61,19.68 90 top
C4  13.97,39.05 270 top
C5  16.83,39.05 270 top
C6  7.56,31.43 90 top
C7  5.02,31.43 90 top
C8  100.33,53.43 270 top
C9  77.15,46.67 0 top
C10  52.7,19.68 90 top
C11  14.55,28.91 270 top
C12  12.67,8.69 180 top
C13  25.88,15.04 0 top
D1  94.92,10.72 270 top
D2  94.36,16.61 270 top
D3  94.46,21.59 270 top
D4  94.62,29.57 90 top
D5  92.99,10.72 270 top
D6  92.63,16.61 270 top
D7  92.58,21.59 270 top
D8  92.74,29.57 90 top
D9  73.03,36.83 0 top
IC1  40.64,18.73 180 top
IC2  48.58,18.73 180 top
IC3  22.23,28.57 0 top
PTC  64.77,36.83 0 top
Q1  31.12,42.86 270 top
Q2  26.67,42.86 270 top
Q3  72.61,12.03 270 top
Q4  76.73,12.03 90 top
Q5  39.37,42.86 270 top
Q6  35.24,42.86 270 top
Q7  72.61,16.79 270 top
Q8  76.73,16.79 90 top
Q9  48.26,42.86 270 top
Q10  43.5,42.86 270 top
Q11  72.61,21.23 270 top
Q12  76.73,21.23 90 top
Q13  56.52,42.86 270 top
Q14  52.39,42.86 270 top
Q15  72.61,25.68 270 top
Q16  76.73,25.68 90 top
R1  102.63,53.43 270 top
R2  20,46.04 90 top
R3  32.07,46.04 270 top
R4  80.65,48.26 270 top
R5  33.34,46.04 270 top
R6  29.85,38.1 270 top
R7  66.89,11.71 0 top
R8  66.89,12.98 180 top
R9  30.29,46.04 270 top
R10  25.72,38.1 270 top
R11  28.89,46.04 90 top
R12  63.08,12.98 180 top
R13  63.08,11.71 0 top
R14  40.32,46.04 270 top
R15  39.05,46.04 270 top
R16  37.46,38.1 270 top
R17  66.89,16.15 0 top
R18  66.89,17.42 180 top
R19  37.15,46.04 270 top
R20  33.65,38.1 270 top
R21  35.88,46.04 90 top
R22  63.08,17.42 180 top
R23  63.08,16.03 0 top
R24  45.4,46.04 270 top
R25  46.67,46.04 270 top
R26  44.77,38.1 270 top
R27  66.89,21.55 0 top
R28  66.89,20.28 180 top
R29  43.5,46.04 270 top
R30  40.96,38.1 270 top
R31  42.23,46.04 90 top
R32  63.08,21.55 180 top
R33  63.08,20.28 0 top
R34  50.8,46.04 270 top
R35  52.07,46.04 270 top
R36  52.39,38.1 270 top
R37  66.89,24.09 0 top
R38  66.89,25.49 180 top
R39  48.26,46.04 270 top
R40  48.89,38.1 270 top
R41  49.53,46.04 90 top
R42  63.08,25.36 180 top
R43  63.08,24.09 0 top
R44  42.54,24.77 90 top
R45  40,24.77 90 top
R46  39.69,12.07 90 top
R47  41.91,12.07 90 top
R48  46.04,12.07 270 top
R49  52.39,12.07 270 top
R50  49.53,24.77 90 top
R51  46.35,25.4 90 top
R52  47.94,12.07 90 top
R53  50.48,12.07 90 top
R54  37.78,12.07 270 top
R55  43.81,12.07 270 top
R56  21.06,16.51 0 top
R57  21.26,13.67 0 top
R58  23.9,34.54 270 top
R59  24.92,21.64 90 top
R60  20.4,21.74 90 top
R61  15.98,24.59 0 top
R62  15.98,26.16 0 top
R63  21.82,21.74 90 top
R64  25.17,19.3 0 top
R65  22.28,35.05 270 top
TVS  73.03,31.75 0 top
U1  10.13,13.16 0 top
U2  77.47,43.81 180 top
U3  66.68,43.5 180 top
U9  8.25,40.32 90 top
U$2  104.44,47.94 180 top
ZEN  65.02,31.88 0 top

### Tracks (layer width: path | path; a pad name or v marks a point on that pad's centre or on a via)
12V_IN  (via drill 0.6)
  Top 0.406: v74.61,39.37 74.61,36.85 D9.A
  Bottom 0.406: v74.61,39.37 80.65,45.4 81.92,45.4 81.92,46.23 82.5,46.76 89.61,46.76 90.96,50.55 103.05,50.55 104.45,49.15 U$2.P$1
+3V3  (via drill 0.38)
  Top 0.254: v52.39,14.61 R49.1 | R55.1 43.81,13.34 v44.77,14.29 46.04,13.02 R48.1 | R54.1 37.78,13.97 v37.46,14.29 | R2.1 v20,43.81 | v80.33,43.18 79.07,42.86 U2.5 | C1.1 72.81,46.14 v72.71,46.04 | IC3.11 22.23,32.87 21.46,33.48 20.32,33.48 19.69,32.92 IC3.13 IC3.14 15.98,31.65 v15.87,31.75 14.6,30.48 C11.1 | U1.PIN3 13.52,12.31 C12.1 13.52,6.36 v13.84,6.04
  pour Route2: 0.13,57.15 114.94,57.15 114.94,0 0,0
+5V
  pour Top: 0.13,57.15 114.94,57.15 114.94,0 0,0
+12V  (via drill 0.38, 0.6, 0.7)
  Top 0.254: R10.2 25.72,37.46 v27.94,37.46 29.85,37.46 R6.2 | R16.2 37.46,37.46 v35.56,37.46 33.65,37.46 R20.2 | R30.2 40.96,37.46 v42.86,37.46 44.77,37.46 R26.2 | R40.2 48.89,37.46 v50.8,37.46 52.39,37.46 R36.2 | R11.2 v28.89,47.94 | R21.2 35.88,47.62 v35.24,48.26 | R31.2 v42.23,48.26 | v49.53,48.26 R41.2 | R8.2 66.31,13.24 v65.62,13.93 | R18.2 66.31,18 v65.62,18.38 | R28.2 66.26,20.23 65.36,20.23 v65.11,20.73 | R38.2 66.31,26.05 66.26,26.95 v65.94,27.27
  Top 0.406: C5.2 C4.2 10.43,38.15 U9.P$1 | Q7.2 70.7,15.84 v69.62,17.17 | Q3.2 70.38,11.08 v69.75,11.71 | Q11.2 70.7,20.28 v69.75,21.23 | Q15.2 70.7,24.73 v69.75,25.68 | ZEN.C 62.82,36.68 PTC.P$1 | D5.A 93.29,9.57 v93.29,7.98 | D6.A 92.02,16.12 v91.26,16.26 | D7.A 91.8,20.44 v90.91,21.39 | D8.A 92.73,33.02 v92.58,33.17
  Top 0.61: PTC.P$1 62.67,37.66 v60.64,39.69 v60.64,42.86
  other vias: 60.64,41.27
  pour Route15: 0.13,57.15 114.94,57.15 114.94,0 0,0
CAN_EN  (via drill 0.38)
  Top 0.254: v16.48,14.73 16.48,15.7 U1.PIN5
  Route2 0.254: ARDUINO_DUE1.51 89.43,14.99 92.02,12.39 92.02,3 90.2,1.17 13.28,1.17 7.9,6.55 7.9,14.07 8.56,14.73 v16.48,14.73
CAN_RX  (via drill 0.38)
  Top 0.254: v15.93,10.26 15.93,11.18 U1.PIN4
  Route2 0.254: ARDUINO_DUE1.DAC0 74.8,3 74.35,2.54 17.14,2.54 15.93,3.76 v15.93,10.26
CAN_TX  (via drill 0.38)
  Top 0.254: v9.98,10.57 9.98,11.73 U1.PIN1
  Route2 0.254: ARDUINO_DUE1.53 89.74,12.45 90.7,11.48 90.7,2.74 89.33,1.83 14.6,1.83 9.98,6.1 v9.98,10.57
CANH  (via drill 0.38)
  Top 0.254: R56.1 17.11,19.71 12.47,19.71 12.04,19.18 U1.PIN7 12.01,17.63 v12.01,20.98
  Route15 0.254: U$2.P$15 100.2,31.14 101.17,30.18 101.17,3.5 97.77,2.39 14.1,2.39 12.01,3.81 v12.01,20.98
CANL  (via drill 0.38)
  Top 0.254: U1.PIN6 13.31,18.77 13.54,19 16.69,19 18.36,16.97 18.36,14.99 18.92,13.66 R57.1 20.14,13.45 20.14,12.09 18.82,10.92 18.82,9.55 16.94,7.92 16.94,6.55 14.2,3.81 12.98,3.81 11.05,2.23 v11.05,1.73
  Route15 0.254: U$2.P$14 99.56,35.34 101.78,32.97 101.88,32.77 101.83,2.9 98.68,1.52 97.51,1.52 18.16,1.63 11.96,1.63 v11.05,1.73
D1A
  Top 0.254: R3.1 32.07,52.51 ARDUINO_DUE1.8
D1B  (via drill 0.38)
  Top 0.254: v17.86,22.7 15.99,22.7 15.42,23.27 15.42,24.57 R61.1
  Route2 0.254: ARDUINO_DUE1.9 30.1,51.69 19.69,41.27 19.69,23.81 v17.86,22.7
D1BB  (via drill 0.38)
  Top 0.254: IC3.2 19.69,26.99 v20.96,28.26 | v30.29,49.53 R9.1
  Route2 0.254: v20.96,28.26 20.96,40.32 26.35,45.72 29.27,45.72 R9.1 v30.29,49.53
D2A
  Top 0.254: R14.1 40.32,52.01 ARDUINO_DUE1.6
D2B  (via drill 0.38)
  Top 0.254: v20.4,19.3 R60.1
  Route2 0.254: ARDUINO_DUE1.7 35.31,53.09 31.43,49.21 31.43,45.09 24.45,38.1 24.45,25.72 20.96,22.22 20.96,19.86 v20.4,19.3
D2BB  (via drill 0.38)
  Top 0.254: IC3.4 22.23,27.3 23.5,28.57 28.58,28.57 v28.89,28.89 | v36.51,50.48 36.51,49.53 37.15,48.89 R19.1
  Bottom 0.254: v28.89,28.89 30.16,28.89 37.46,36.2 37.46,39.05 39.37,40.96 39.37,45.4 37.15,47.62 37.15,49.85 v36.51,50.48
D3A
  Top 0.254: R24.1 45.4,52.01 ARDUINO_DUE1.4
D3B  (via drill 0.38)
  Top 0.254: v25.82,34.63 25.16,35.17 24.56,35.15 23.93,35.15 R58.1
  Route2 0.254: ARDUINO_DUE1.5 41.78,52.58 38.73,49.53 38.42,49.53 37.46,48.58 37.46,44.77 35.24,42.55 35.24,40.32 30.8,35.88 27.62,35.88 v25.82,34.63
D3BB  (via drill 0.38)
  Top 0.254: IC3.8 26.04,32.07 v27.94,33.97 | v43.18,50.48 43.5,50.16 R29.1
  Route2 0.254: v27.94,33.97 30.16,33.97 34.61,38.42 36.51,38.42 38.42,40.32 38.42,44.13 40.32,46.04 40.32,48.89 41.91,50.48 v43.18,50.48
D4A
  Top 0.254: R34.1 50.8,51.69 ARDUINO_DUE1.2
D4B  (via drill 0.38)
  Top 0.254: v23.55,21.54 23.55,21.18 24.11,21.03 24.69,21.03 R59.1
  Route2 0.254: ARDUINO_DUE1.3 46.86,51.63 44.77,49.53 44.77,44.77 43.18,43.18 40.32,43.18 39.37,42.23 39.37,32.07 31.03,24.31 31.03,24.29 29.29,22.55 24.36,22.55 v23.55,21.54
D4BB  (via drill 0.38)
  Top 0.254: IC3.6 24.77,23.81 26.3,23.81 27.96,22.15 27.96,20.98 v27.94,20.95 | R39.1 v48.26,49.85
  Route2 0.254: v48.26,49.85 46.04,49.85 45.4,49.21 45.4,43.81 43.81,42.23 43.81,40.64 41.27,38.1 41.27,32.38 29.85,20.95 v27.94,20.95
DIN1  (via drill 0.6)
  Top 0.254: v44.45,21.27 44.45,25.08 43.81,25.72 42.65,25.72 R44.2
  Bottom 0.254: v44.45,21.27 46.35,20 51.75,20 52.39,19.37 62.13,19.01 65.25,16.24 65.27,16.24 65.81,15.7 83.54,15.7 84.1,16.26 90.03,16.26 90.04,16.24 90.1,12.26 102.26,12.26 U$2.P$9
DIN2  (via drill 0.6)
  Top 0.254: v36.83,25.72 39.9,25.72 R45.2
  Bottom 0.254: v36.83,25.72 40,22.54 65.94,22.19 68.16,20.15 68.22,20.09 72.42,20.09 72.61,20.28 82.21,20.28 83.74,18.8 89.18,18.8 89.43,18.49 93.09,18.49 96.7,16.41 102.31,16.41 U$2.P$8
DIN3  (via drill 0.6)
  Top 0.254: R50.2 48.68,25.93 48.58,26.04 v48.58,27.3
  Bottom 0.254: v48.58,27.3 60.86,26.95 63.4,24.41 83.46,24.41 83.9,23.93 89.62,23.93 90.71,22.89 94.73,22.64 96.75,20.62 102.33,20.62 U$2.P$7
DIN4  (via drill 0.6)
  Top 0.254: R51.2 46.35,28.26 v45.72,28.89
  Bottom 0.254: v45.72,28.89 86.2,28.94 86.3,26.38 95.36,26.33 97,24.89 102.39,24.89 U$2.P$6
DOUT1
  Top 0.406: Q4.3 74.56,12.03 | 74.56,12.03 74.56,13.99 83.73,13.99 84,13.72 94.97,13.72 | Q3.3 74.56,12.03 | 94.97,13.72 95.78,14.43 98.86,14.43 U$2.P$19 | 94.97,13.72 94.97,13.66 D1.C D5.C
DOUT2
  Top 0.406: Q8.3 75.15,16.79 | 75.15,16.79 75.15,19.01 78.96,19.01 80.42,18.19 83.24,18.19 83.84,18.8 94.36,18.74 | Q7.3 75.15,16.79 | 98.89,18.49 U$2.P$18 98.69,18.8 94.36,18.74 | 94.36,18.74 D2.C D6.C
DOUT3
  Top 0.406: Q12.3 74.87,21.23 | 74.87,21.23 74.87,23.46 78.96,23.46 81.52,24.01 83.91,24.01 84,23.88 94.46,23.88 | Q11.3 74.87,21.23 | U$2.P$17 98.91,22.71 96.34,22.71 95.29,23.76 95.12,23.88 94.46,23.88 | 94.46,23.88 D3.C D7.C
DOUT4
  Top 0.406: Q15.3 Q16.3 75.56,25.75 75.56,27.28 76.19,27.9 79.91,27.9 83.36,26.48 83.36,26.45 83.39,26.42 94.62,26.42 | U$2.P$16 98.93,26.92 96.29,26.92 95.7,26.43 95.41,26.42 94.62,26.42 | 94.62,26.42 D4.C D8.C
FAULT
  Top 0.254: U$2.P$2 107.49,45.85 107.49,50.04 105.59,51.12 104.51,51.16 103.67,51.77 R1.2
GND  (via drill 0.38, 0.6)
  Top 0.254: Q4.2 78.96,12.98 v79.27,12.66 | v79.27,26.63 Q16.2 | v79.27,21.55 78.37,21.55 Q12.2 | Q8.2 78.64,17.74 v79.27,17.49 | R25.1 v46.67,48.26 | R35.1 v52.07,48.58 | Q13.2 55.25,41.91 v54.29,40.96 | Q14.2 50.8,41.91 v50.16,41.27 | Q9.2 46.36,41.91 v45.72,41.27 | Q10.2 42.23,41.91 v41.27,40.96 | Q5.2 38.1,41.91 v37.27,40.96 | R15.1 v39.05,47.94 | R5.1 v33.34,47.94 | Q6.2 34.24,41.86 v33.34,40.96 | Q1.2 30.12,41.86 v29.21,40.96 | Q2.2 25.4,41.91 v24.45,40.96 22.33,38.84 R65.1 | IC2.5 46.67,17.78 46.99,18.1 | 46.99,18.1 48.89,18.1 49.21,17.78 | 49.21,17.78 IC2.7 | IC2.2 49.21,18.41 | 49.21,18.41 49.21,17.78 | IC2.4 46.67,18.41 46.99,18.1 | C8.2 99.61,52.58 v97.04,52.55 | C9.1 76.3,45.28 | 76.3,45.28 U2.3 | C1.2 75.46,44.66 v75.56,45.09 76.11,45.09 76.3,45.28 | C2.1 63.92,44.45 U3.3 66.03,44.78 v65.41,45.4 | IC1.5 38.73,18.1 39.37,18.73 | 39.37,18.73 40.96,18.73 41.12,18.57 | 41.12,18.57 41.27,18.41 IC1.7 | IC1.2 41.27,18.73 | 41.27,18.73 41.12,18.57 | IC1.4 38.73,19.37 39.37,18.73 | v42.23,18.73 41.27,18.73 | 49.21,18.41 49.53,18.73 v50.16,18.73 52.6,18.73 C10.1 C3.1 | R13.1 62.5,11.45 v61.49,10.44 | R23.1 v61.18,16.15 | R33.1 v61.18,20.28 | R43.1 v61.18,24.09 | C6.2 C7.2 | IC3.7 28.79,25.5 v29.52,26.15 | ZEN.A 67.22,31.45 | 75.18,31.63 TVS.A | v12.62,28.03 C11.2 14.55,26.97 15.37,26.16 R62.1 | C12.2 11.82,12.31 U1.PIN2 12.04,14.71 10.74,16 10.74,17.58 U1.PIN8 v8.67,17.6 v8.66,17.61 | C13.2 28.54,15.04 v30.43,14.72 | R63.1 22.04,21.16 22.63,20.57 v22.63,19.29 22.64,19.3 R64.1
  Top 0.305: U9.P$2 7.17,40.31 5.08,38.23 5.08,32.4 C7.2
  Top 0.406: U9.P$2 13.61,40.31 C4.1 C5.1 | TVS.A 74.43,32.2 v76.71,33.84 | 67.22,31.45 69.47,29.21 74.55,29.21 75.18,29.84 75.18,31.63 | D1.A 98.17,9.57 U$2.P$20 | D4.A 94.92,31.75 v94.92,32.97 | D3.A 95.56,20.44 v95.99,19.81 | D2.A 95.19,15.31 v96.04,15.44
  Route2 0.406: v95.99,19.81 95.99,16.15 v96.04,15.44 96.04,13.41 97.21,11.99 97.21,11.89 98.63,10.52 98.63,10.46 U$2.P$20
  Route15 0.406: v79.27,26.63 v79.27,21.55 | v61.18,24.09 v61.18,20.28
  pour Bottom: 0.13,57.15 114.94,57.15 114.94,0 0,0
IN1
  Top 0.254: R54.2 R46.1 39.69,9.21 41.91,6.99 41.91,4.95 ARDUINO_DUE1.A0
IN2
  Top 0.254: R47.1 R55.2 43.81,7.3 44.13,6.99 44.13,5.02 ARDUINO_DUE1.A1
IN3
  Top 0.254: R52.1 R48.2 46.04,7.3 46.67,6.67 46.67,5.02 ARDUINO_DUE1.A2
IN4
  Top 0.254: R49.2 R53.1 50.48,7.94 49.53,6.99 49.53,4.95 ARDUINO_DUE1.A3
N$1
  Top 0.406: D9.C 70.48,36.83 | D9.C PTC.P$2 | D9.C 70.95,31.92 TVS.C
N$2
  Top 0.254: U2.4 73.66,42.87 71.76,43.81 71.76,52.58 ARDUINO_DUE1.19
N$3
  Top 0.254: ARDUINO_DUE1.18 69.72,46.85 U3.1
  Top 0.406: U3.1 U3.2
N$4
  Top 0.254: R5.2 R3.2 32.07,45.09 31.12,44.13 30.44,44.13 Q1.1
N$5
  Top 0.254: R7.2 R8.1 68.11,13.61 71.02,13.61 71.61,13.03 Q3.1
N$6
  Top 0.254: R45.1 IC1.3
N$7  (via drill 0.38)
  Top 0.254: R2.2 20,53.02 ARDUINO_DUE1.13 20,53.15 | R1.1 C8.1 95.56,54.28
  Top 0.406: 95.56,54.28 v95.53,54.3
  Route2 0.254: v95.53,54.3 92.33,54.3 90.6,56.03 21.06,56.03 19.94,54.91 ARDUINO_DUE1.13
N$8
  Top 0.254: Q1.3 32.21,41.05 30.19,39.02 | 30.19,39.02 R6.1 | R7.1 65.94,11.71 64.67,12.98 64.67,13.61 63.72,14.57 61.18,14.57 59.94,15.27 58.88,18.47 49.71,32.7 34.61,32.7 31.75,35.56 31.75,37.46 30.19,39.02
N$9
  Top 0.254: R4.2 C9.2 78,45.2 U2.1
  Top 0.406: U2.1 U2.2
N$10
  Top 0.254: R14.2 R15.2 39.05,44.49 Q5.1
N$11
  Top 0.254: R9.2 R11.1 26.41,45.46 25.72,44.77 25.72,43.86 Q2.1
N$12
  Top 0.254: R12.1 R13.2 64.03,11.71 65.94,9.8 76.46,9.8 Q4.1
N$13
  Top 0.254: Q2.3 27.77,40.73 R10.1 25.66,38.73 24.8,38.73 24.47,38.05 24.47,37.1 25.36,36.01 30.3,36.05 34.29,32.07 49.09,32.07 58.23,17.79 59.4,14.03 61.25,12.93 R12.2
N$14
  Top 0.254: Q5.3 40.47,41.69 37.97,39.18 | 37.97,39.18 R16.1 | R17.1 65.94,16.15 64.67,17.42 64.67,18.06 63.97,18.76 60.44,18.76 50.39,34.29 45.09,34.29 44.77,34.61 39.69,34.61 38.73,35.56 38.73,38.42 37.97,39.18
N$15
  Top 0.254: R17.2 R18.1 67.53,17.48 67.53,18.06 67.84,18.38 70.7,18.38 71.34,17.74 Q7.1
N$16
  Top 0.254: R19.2 R21.1 35.88,44.45 35.24,43.81 Q6.1
N$17
  Top 0.254: R22.1 R23.2 64.35,16.03 65.3,14.88 77.1,14.88 Q8.1
N$18
  Top 0.254: Q6.3 36.34,41.37 R20.1 33.6,38.73 32.7,38.73 32.38,38.42 32.38,36.2 34.61,33.97 44.45,33.97 44.77,33.66 49.87,33.66 60.2,17.63 R22.2
N$19
  Top 0.254: R24.2 R25.2 46.67,44.4 Q9.1
N$20
  Top 0.254: Q9.3 49.36,42.64 48.99,42.64 48.26,41.91 48.26,40.96 45.91,38.61 | R26.1 45.66,38.54 45.91,38.61 | R27.1 65.94,21.55 64.67,22.82 60.54,22.82 59.52,23.68 58.25,25.87 51.43,35.56 46.99,35.56 46.35,36.2 46.35,38.16 45.91,38.61
N$21
  Top 0.254: R28.1 R27.2 67.53,21.61 67.53,22.19 67.84,22.38 70.38,22.38 70.7,22.18 Q11.1
N$22
  Top 0.254: Q10.1 42.23,44.08 R31.1 R29.2
N$23
  Top 0.254: R32.1 R33.2 64.03,20.28 64.99,19.33 74.19,19.33 75.15,20.28 Q12.1
N$24
  Top 0.254: Q10.3 44.6,42.32 R30.1 40.9,38.73 40,38.73 39.69,38.42 39.69,36.51 40.64,35.56 45.4,35.56 46.04,34.92 50.81,34.92 57.87,24.78 59.33,22.44 60.22,21.55 R32.2
N$25
  Top 0.254: R34.2 R35.2 53.87,45.46 Q13.1
N$26
  Top 0.254: Q13.3 57.61,41.69 53.98,39.6 | 53.98,39.6 R36.1 | R37.1 65.94,24.09 64.99,25.04 64.99,26 63.72,27.27 61.25,27.27 53.97,35.56 53.97,39.59 53.98,39.6
N$27
  Top 0.254: R37.2 R38.1 67.53,25.42 67.53,26.63 68.16,27.27 71.02,27.27 71.61,26.68 Q15.1
N$28
  Top 0.254: R39.2 R41.1 49.53,45.09 50.8,43.81 Q14.1
N$29
  Top 0.254: Q16.1 75.15,24.73 73.88,23.46 70.38,23.46 68.35,23.01 65.49,23.01 64.67,24.09 R43.2 R42.1
N$30
  Top 0.254: Q14.3 53.49,41.69 R40.1 48.84,38.73 47.94,38.73 47.62,38.42 47.62,36.51 47.94,36.2 51.9,36.2 59.04,26.31 60.22,26.31 61.18,25.36 R42.2
N$31
  Top 0.254: R44.1 IC1.1
N$32
  Top 0.254: IC2.6 R52.2
N$33
  Top 0.254: R57.2 22.21,15.04 | 22.21,15.04 22.16,16.2 R56.2 | C13.1 22.21,15.04
N$34
  Top 0.254: IC3.9 24.82,31.7 24.82,33.07 23.9,33.73 R58.2 23.24,33.96 R65.2
N$35
  Top 0.254: IC3.5 23.5,23.19 R59.2 25.66,22.22 25.93,21.69 25.93,19.33 R64.2
N$36
  Top 0.254: IC2.8 R53.2
N$37
  Top 0.254: IC1.6 40,13.23 R46.2
N$38
  Top 0.254: IC1.8 42.54,13.55 R47.2
N$39
  Top 0.254: R63.2 R60.2 20.4,23.16 20.96,23.72 IC3.3
N$40
  Top 0.254: R61.2 R62.2 17.76,26.16 IC3.1
N$41
  Top 0.254: IC2.1 50.48,22.96 R50.1
N$42
  Top 0.406: IC2.3 47.94,22.96 R51.1
RX
  Top 0.254: U$2.P$11 95.91,49.09 92.67,49.19 88.65,49.28 80.81,49.28 R4.1
TX  (via drill 0.38)
  Top 0.254: U3.4 66.03,41.92 v66.99,40.96
  Route2 0.254: v66.99,40.96 81.6,40.96 82.87,39.69 84.47,39.13 94.88,39.03 95.53,39.52 98.93,39.52 U$2.P$13

### Text on the board
tNames: U1